# Altium schematic sheet Webcam_Server.SchDoc
size A
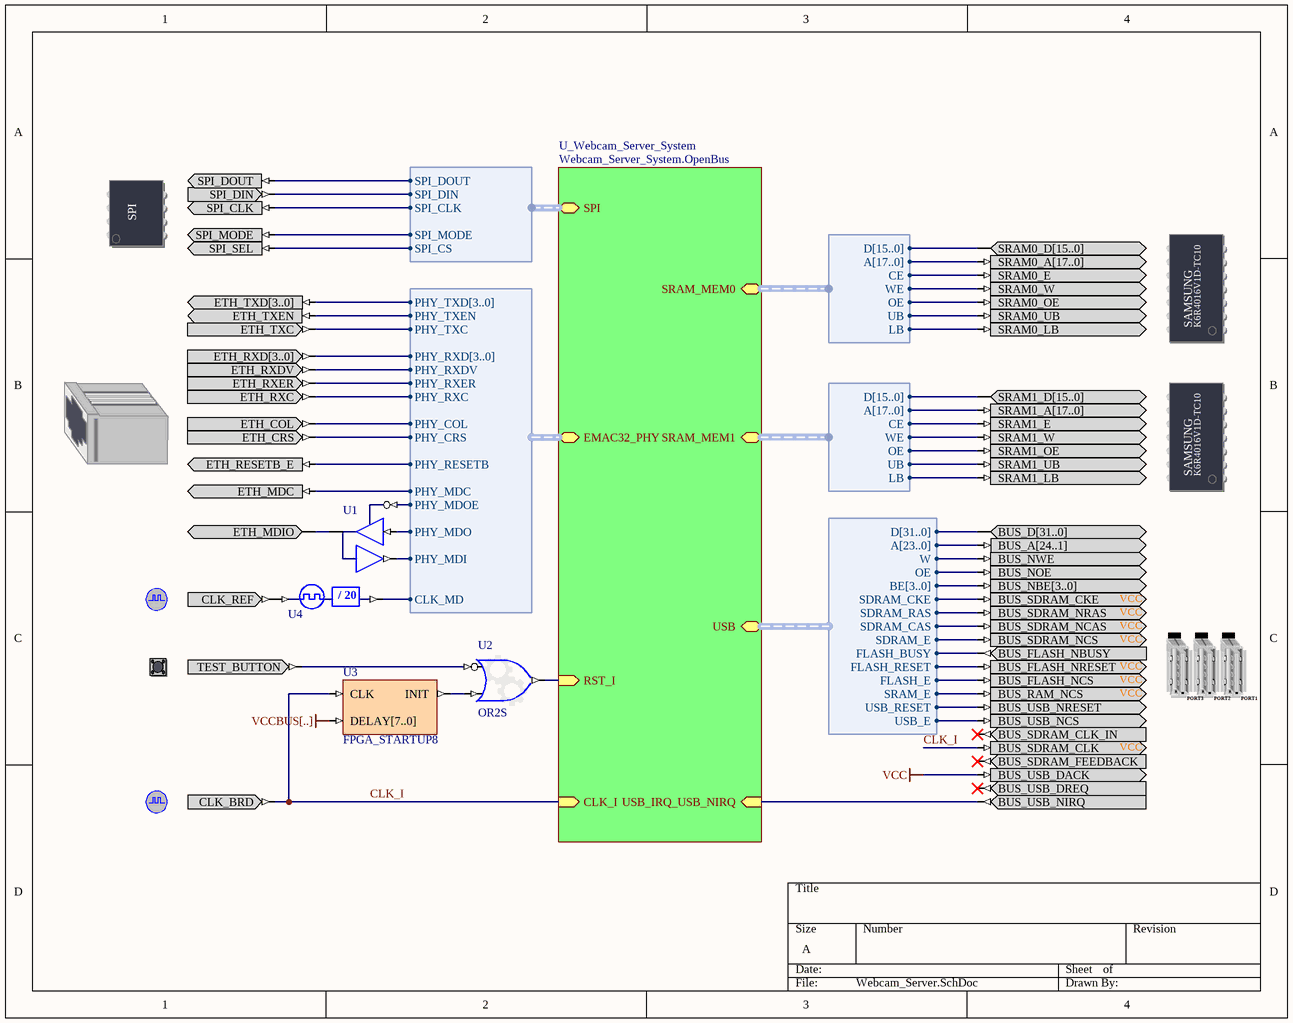
[diagram p0: Webcam_Server.SchDoc]

## Parts
(Parts that share a designator on the sheet are numbered #1, #2 ... from top to bottom, then left to right.)
?#1  SERIALFMEMORY  (value not drawn)
?#2  SRAM_DAUGHTER0  (value not drawn)
?#3  ETH_PHY  (value not drawn)
?#4  SRAM_DAUGHTER1  (value not drawn)
?#5  SHARED_USB  (value not drawn)
?#6  CLOCK_REFERENCE  (value not drawn)
?#7  TEST_BUTTON  (value not drawn)
?#8  CLOCK_BOARD  (value not drawn)
U1  IOBUF  (value not drawn)
U2  OR2S
U3  FPGA_STARTUP8
U4  CDIV20DC50  (value not drawn)

## Sub-sheets
U_Webcam_Server_System = Webcam_Server_System.OpenBus: EMAC32_PHY (harness EMAC32), SRAM_MEM0 (harness WB_MEM_CTRL_SRAM16_A18), SRAM_MEM1 (harness WB_MEM_CTRL_SRAM16_A18), RST_I (in), CLK_I (in), USB_IRQ_USB_NIRQ (in), USB (harness WB_SHARED_MEM_CTRL), SPI (harness SPI_W_NB)

## Harnesses
WB_MEM_CTRL_SRAM16_A18: D[15..0], A[17..0], CE, WE, OE, UB, LB
EMAC32: PHY_TXD[3..0], PHY_TXEN, PHY_TXC, PHY_RXD[3..0], PHY_RXDV, PHY_RXER, PHY_RXC, PHY_COL, PHY_CRS, PHY_RESETB, PHY_MDC, PHY_MDOE, PHY_MDO, PHY_MDI, CLK_MD
WB_SHARED_MEM_CTRL: D[31..0], A[23..0], W, OE, BE[3..0], SDRAM_CKE, SDRAM_RAS, SDRAM_CAS, SDRAM_E, FLASH_BUSY, FLASH_RESET, FLASH_E, SRAM_E, USB_RESET, USB_E
SPI_W_NB: SPI_DOUT, SPI_DIN, SPI_CLK, SPI_CS, SPI_MODE

## Nets
VCC: ?#5.BUS_USB_DACK
VCCBUS[..]: U3.DELAY[7..0]
CLK_I: ?#5.BUS_SDRAM_CLK ?#8.CLK_BRD U3.CLK ; sheet U_Webcam_Server_System/CLK_I
Net?#1_SPI_CLK: ?#1.SPI_CLK ; sheet U_Webcam_Server_System/SPI.SPI_CLK
Net?#1_SPI_DIN: ?#1.SPI_DIN ; sheet U_Webcam_Server_System/SPI.SPI_DIN
Net?#1_SPI_DOUT: ?#1.SPI_DOUT ; sheet U_Webcam_Server_System/SPI.SPI_DOUT
Net?#1_SPI_MODE: ?#1.SPI_MODE ; sheet U_Webcam_Server_System/SPI.SPI_MODE
Net?#1_SPI_SEL: ?#1.SPI_SEL ; sheet U_Webcam_Server_System/SPI.SPI_CS
Net?#2_SRAM0_A[17..0]: ?#2.SRAM0_A[17..0] ; sheet U_Webcam_Server_System/SRAM_MEM0.A[17..0]
Net?#2_SRAM0_D[15..0]: ?#2.SRAM0_D[15..0] ; sheet U_Webcam_Server_System/SRAM_MEM0.D[15..0]
Net?#2_SRAM0_E: ?#2.SRAM0_E ; sheet U_Webcam_Server_System/SRAM_MEM0.CE
Net?#2_SRAM0_LB: ?#2.SRAM0_LB ; sheet U_Webcam_Server_System/SRAM_MEM0.LB
Net?#2_SRAM0_OE: ?#2.SRAM0_OE ; sheet U_Webcam_Server_System/SRAM_MEM0.OE
Net?#2_SRAM0_UB: ?#2.SRAM0_UB ; sheet U_Webcam_Server_System/SRAM_MEM0.UB
Net?#2_SRAM0_W: ?#2.SRAM0_W ; sheet U_Webcam_Server_System/SRAM_MEM0.WE
Net?#3_ETH_COL: ?#3.ETH_COL ; sheet U_Webcam_Server_System/EMAC32_PHY.PHY_COL
Net?#3_ETH_CRS: ?#3.ETH_CRS ; sheet U_Webcam_Server_System/EMAC32_PHY.PHY_CRS
Net?#3_ETH_MDC: ?#3.ETH_MDC ; sheet U_Webcam_Server_System/EMAC32_PHY.PHY_MDC
Net?#3_ETH_MDIO: ?#3.ETH_MDIO U1.IO
Net?#3_ETH_RESETB_E: ?#3.ETH_RESETB_E ; sheet U_Webcam_Server_System/EMAC32_PHY.PHY_RESETB
Net?#3_ETH_RXC: ?#3.ETH_RXC ; sheet U_Webcam_Server_System/EMAC32_PHY.PHY_RXC
Net?#3_ETH_RXD[3..0]: ?#3.ETH_RXD[3..0] ; sheet U_Webcam_Server_System/EMAC32_PHY.PHY_RXD[3..0]
Net?#3_ETH_RXDV: ?#3.ETH_RXDV ; sheet U_Webcam_Server_System/EMAC32_PHY.PHY_RXDV
Net?#3_ETH_RXER: ?#3.ETH_RXER ; sheet U_Webcam_Server_System/EMAC32_PHY.PHY_RXER
Net?#3_ETH_TXC: ?#3.ETH_TXC ; sheet U_Webcam_Server_System/EMAC32_PHY.PHY_TXC
Net?#3_ETH_TXD[3..0]: ?#3.ETH_TXD[3..0] ; sheet U_Webcam_Server_System/EMAC32_PHY.PHY_TXD[3..0]
Net?#3_ETH_TXEN: ?#3.ETH_TXEN ; sheet U_Webcam_Server_System/EMAC32_PHY.PHY_TXEN
Net?#4_SRAM1_A[17..0]: ?#4.SRAM1_A[17..0] ; sheet U_Webcam_Server_System/SRAM_MEM1.A[17..0]
Net?#4_SRAM1_D[15..0]: ?#4.SRAM1_D[15..0] ; sheet U_Webcam_Server_System/SRAM_MEM1.D[15..0]
Net?#4_SRAM1_E: ?#4.SRAM1_E ; sheet U_Webcam_Server_System/SRAM_MEM1.CE
Net?#4_SRAM1_LB: ?#4.SRAM1_LB ; sheet U_Webcam_Server_System/SRAM_MEM1.LB
Net?#4_SRAM1_OE: ?#4.SRAM1_OE ; sheet U_Webcam_Server_System/SRAM_MEM1.OE
Net?#4_SRAM1_UB: ?#4.SRAM1_UB ; sheet U_Webcam_Server_System/SRAM_MEM1.UB
Net?#4_SRAM1_W: ?#4.SRAM1_W ; sheet U_Webcam_Server_System/SRAM_MEM1.WE
Net?#5_BUS_A[24..1]: ?#5.BUS_A[24..1] ; sheet U_Webcam_Server_System/USB.A[23..0]
Net?#5_BUS_D[31..0]: ?#5.BUS_D[31..0] ; sheet U_Webcam_Server_System/USB.D[31..0]
Net?#5_BUS_FLASH_NBUSY: ?#5.BUS_FLASH_NBUSY ; sheet U_Webcam_Server_System/USB.FLASH_BUSY
Net?#5_BUS_FLASH_NCS: ?#5.BUS_FLASH_NCS ; sheet U_Webcam_Server_System/USB.FLASH_E
Net?#5_BUS_FLASH_NRESET: ?#5.BUS_FLASH_NRESET ; sheet U_Webcam_Server_System/USB.FLASH_RESET
Net?#5_BUS_NBE[3..0]: ?#5.BUS_NBE[3..0] ; sheet U_Webcam_Server_System/USB.BE[3..0]
Net?#5_BUS_NOE: ?#5.BUS_NOE ; sheet U_Webcam_Server_System/USB.OE
Net?#5_BUS_NWE: ?#5.BUS_NWE ; sheet U_Webcam_Server_System/USB.W
Net?#5_BUS_RAM_NCS: ?#5.BUS_RAM_NCS ; sheet U_Webcam_Server_System/USB.SRAM_E
Net?#5_BUS_SDRAM_CKE: ?#5.BUS_SDRAM_CKE ; sheet U_Webcam_Server_System/USB.SDRAM_CKE
Net?#5_BUS_SDRAM_NCAS: ?#5.BUS_SDRAM_NCAS ; sheet U_Webcam_Server_System/USB.SDRAM_CAS
Net?#5_BUS_SDRAM_NCS: ?#5.BUS_SDRAM_NCS ; sheet U_Webcam_Server_System/USB.SDRAM_E
Net?#5_BUS_SDRAM_NRAS: ?#5.BUS_SDRAM_NRAS ; sheet U_Webcam_Server_System/USB.SDRAM_RAS
Net?#5_BUS_USB_NCS: ?#5.BUS_USB_NCS ; sheet U_Webcam_Server_System/USB.USB_E
Net?#5_BUS_USB_NIRQ: ?#5.BUS_USB_NIRQ ; sheet U_Webcam_Server_System/USB_IRQ_USB_NIRQ
Net?#5_BUS_USB_NRESET: ?#5.BUS_USB_NRESET ; sheet U_Webcam_Server_System/USB.USB_RESET
Net?#6_CLK_REF: ?#6.CLK_REF U4.CLKIN
Net?#7_TEST_BUTTON: ?#7.TEST_BUTTON U2.I0
NetU1_I: U1.I ; sheet U_Webcam_Server_System/EMAC32_PHY.PHY_MDO
NetU1_O: U1.O ; sheet U_Webcam_Server_System/EMAC32_PHY.PHY_MDI
NetU1_T: U1.T ; sheet U_Webcam_Server_System/EMAC32_PHY.PHY_MDOE
NetU2_I1: U2.I1 U3.INIT
NetU2_O: U2.O ; sheet U_Webcam_Server_System/RST_I
NetU4_CLKDV: U4.CLKDV ; sheet U_Webcam_Server_System/EMAC32_PHY.CLK_MD

Not connected (* = marked no-connect by the designer): ?#5 BUS_SDRAM_CLK_IN* BUS_SDRAM_FEEDBACK* BUS_USB_DREQ*

## Notes on the sheet
- (in symbol CDIV20DC50) / 20
- (in symbol SHARED_USB) VCC; USB2; PORT3; PORT2; PORT1
- (in symbol SPI_BUS) SPI
- (in symbol SRAM_DAUGHTER0) SAMSUNG; K6R4016V1D-TC10
- (in symbol SRAM_DAUGHTER1) SAMSUNG; K6R4016V1D-TC10

## Library data of the parts
?#1 = SPI_BUS: Serial SPI Flash RAM; PortComponent: True; Published: 19-Nov-2003; Publisher: Altium Limited; HelpURL: https://wiki.altium.com/display/ADOH/Using+Multiple+SPI+and+I2C+Devices+in+a+Design; UseInDSF: True
?#2 = SRAM_DAUGHTER0: Free Static RAM - Daughterboard; PortComponent: True; Published: 14-May-2007; Publisher: Altium Limited; HelpURL: TR0149 Technical Reference for Altium's Xilinx Spartan-3 Daughter Board DB30.pdf#page=16
?#3 = ETH_PHY: Ethernet PHY-interface; PortComponent: True; Published: 22-Jan-2007; Publisher: Altium Limited; HelpURL: https://wiki.altium.com/display/ADOH/NanoBoard+3000+-+Ethernet+Port
?#4 = SRAM_DAUGHTER1: Free Static RAM - Daughterboard; PortComponent: True; Published: 14-May-2007; Publisher: Altium Limited; HelpURL: TR0149 Technical Reference for Altium's Xilinx Spartan-3 Daughter Board DB30.pdf#page=16
?#5 = SHARED_USB: Common-Bus USB; PortComponent: True; Published: 14-May-2007; Publisher: Altium Limited; HelpURL: https://wiki.altium.com/display/ADOH/Accessing+Common-Bus+Resources+on+the+NanoBoard+3000
?#6 = CLOCK_REFERENCE: Global System Clock Reference Supply; PortComponent: True; Published: 19-Nov-2003; Publisher: Altium Limited; HelpURL: TR0143 Technical Reference Manual for Altium's Desktop NanoBoard NB2DSK01.pdf#page=41
?#7 = TEST_BUTTON: Test / Reset Button; PortComponent: True; Published: 19-Nov-2003; Publisher: Altium Limited; HelpURL: TR0143 Technical Reference Manual for Altium's Desktop NanoBoard NB2DSK01.pdf#page=53
?#8 = CLOCK_BOARD: Global System Clock Supply; PortComponent: True; Published: 19-Nov-2003; Publisher: Altium Limited; HelpURL: TR0143 Technical Reference Manual for Altium's Desktop NanoBoard NB2DSK01.pdf#page=41; UseInDSF: True
U1 = iobuf: Input/Output Buffer; Enable: Low; Control: Common Control T; ArchiveName: GENERIC; VHDLIB_SIM: GENERIC_LIB; Published: 29-Jan-2004; Publisher: Altium Limited; XilinxEquivalent: IOBUF; LastRevisionNo: 1.00.00; HelpURL: CR0118 FPGA Generic Library Guide.pdf#page=293; ComponentLink1URL: CR0125 FPGA Buffer Resource Usage.pdf#page=78; ComponentLink1Description: Core &Resource Usage; FunctionalClass: Buffer; SubClass: IOBUF
U2 = GATE: Configurable Generic Gate; ConfiguratorName: GENERIC_GATE; ConfigurationParameters: {}Version[1.0]{}GateKind[OR]{}BusInput[False]{}GateInputType[Bit]{}GateOutputOption[Normal]{}BusWidth[8]{}RegisterOutputs[False]{}NegativeClockEdge[False]{}InputCount[2]{}InputInvert0[True]{}InputInvert1[False]{}; LastRevisionNo: 1.00.00; Published: 3-Sep-2008; Publisher: Altium Limited
U3 = FPGA_STARTUP8: FPGA Startup With 8 Bit Delay; Published: 9-Dec-2004; Publisher: Altium Limited; HelpURL: CR0119 FPGA_STARTUPx Powerup Delay Unit.pdf; LastRevisionNo: 1.00.00; ComponentLink1Description: Core &Resource Usage; ComponentLink1URL: CR0139 FPGA Peripheral Resource Usage.pdf#page=11
U4 = CDIV20DC50: Clock Divider by 20 with 50% Duty Cycle Output; DivisorRate: 20; DutyCycle: 50; ArchiveName: GENERIC; VHDLIB_SIM: GENERIC_LIB; Published: 29-Jan-2004; Publisher: Altium Limited; LastRevisionNo: 1.00.00; HelpURL: CR0118 FPGA Generic Library Guide.pdf#page=143; ComponentLink1URL: CR0127 FPGA Clock Divider Resource Usage.pdf#page=21; ComponentLink1Description: Core &Resource Usage; FunctionalClass: Clock Divider